# EAGLE design atmegaArduino (EAGLE 7.6.0)
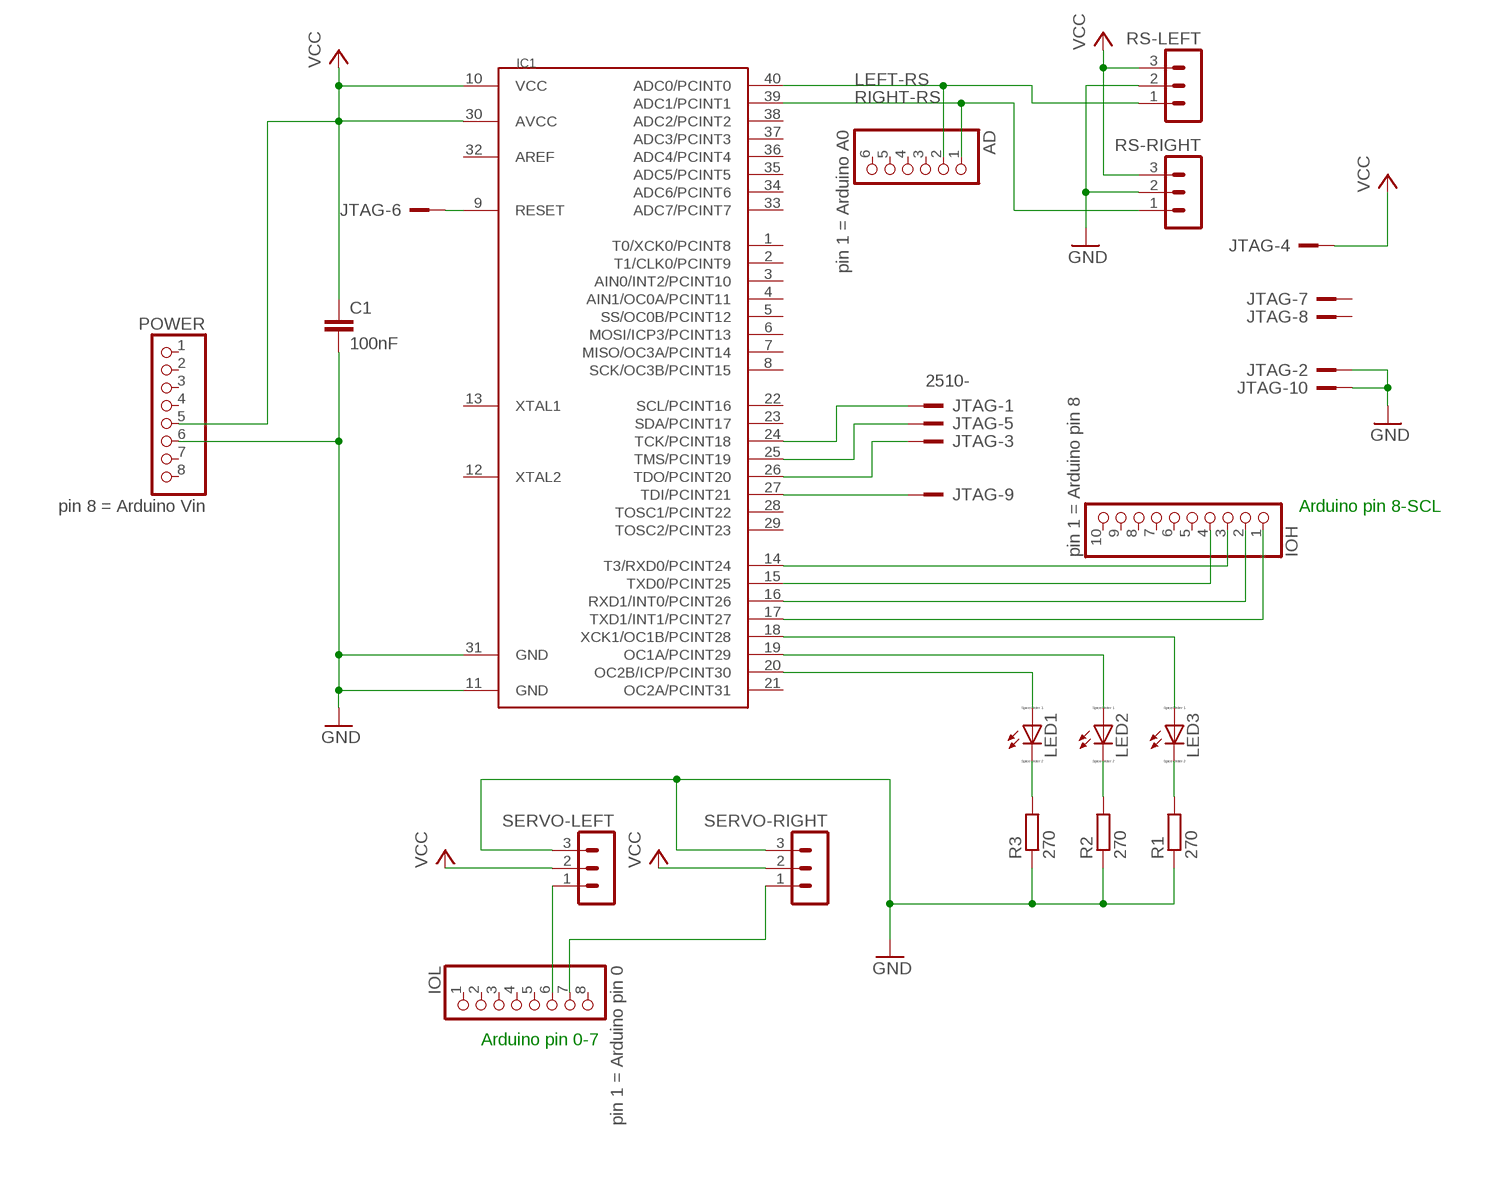
[diagram p0: schematic, sheet 1]

## Parts
AD  pin 1 = Arduino A0  PINHD-1X6/90  [1X06/90]
C1  100nF  C-EU050-025X075  [C050-025X075]
IC1  MEGA1284P  [DIL40]
IOH  pin 1 = Arduino pin 8  PINHD-1X10/90  [1X10/90]
IOL  pin 1 = Arduino pin 0  PINHD-1X8/90  [1X08/90]
JTAG  2510-  [PAK100/2500-10]
LED1  LED_ELD260  [LED_LD260]
LED2  LED_ELD260  [LED_LD260]
LED3  LED_ELD260  [LED_LD260]
POWER  pin 8 = Arduino Vin  PINHD-1X8/90  [1X08/90]
R1  270  R-EU_0204/5  [0204/5]
R2  270  R-EU_0204/5  [0204/5]
R3  270  R-EU_0204/5  [0204/5]
RS-LEFT  MA03-1  [MA03-1]
RS-RIGHT  MA03-1  [MA03-1]
SERVO-LEFT  MA03-1  [MA03-1]
SERVO-RIGHT  MA03-1  [MA03-1]

## Nets
GND: C1.2 IC1.11(GND) IC1.31(GND) JTAG.2 JTAG.10 POWER.6 R1.1 R2.1 R3.1 RS-LEFT.2 RS-RIGHT.2 SERVO-LEFT.3 SERVO-RIGHT.3
LEFT-RS: AD.2 IC1.40(ADC0/PCINT0) RS-LEFT.1
N$1: IC1.14(T3/RXD0/PCINT24) IOH.3
N$2: IC1.15(TXD0/PCINT25) IOH.4
N$3: IC1.24(TCK/PCINT18) JTAG.1
N$4: IC1.25(TMS/PCINT19) JTAG.5
N$6: IC1.26(TDO/PCINT20) JTAG.3
N$7: IOL.7 SERVO-RIGHT.1
N$8: IC1.27(TDI/PCINT21) JTAG.9
N$9: IOL.6 SERVO-LEFT.1
N$11: LED1.K(C) R3.2
N$14: LED2.K(C) R2.2
N$15: IC1.9(RESET) JTAG.6
N$16: LED3.K(C) R1.2
N$17: IC1.20(OC2B/ICP/PCINT30) LED1.A
N$18: IC1.19(OC1A/PCINT29) LED2.A
N$19: IC1.18(XCK1/OC1B/PCINT28) LED3.A
N$20: IC1.16(RXD1/INT0/PCINT26) IOH.2
N$21: IC1.17(TXD1/INT1/PCINT27) IOH.1
RIGHT-RS: AD.1 IC1.39(ADC1/PCINT1) RS-RIGHT.1
VCC: C1.1 IC1.10(VCC) IC1.30(AVCC) JTAG.4 POWER.5 RS-LEFT.3 RS-RIGHT.3 SERVO-LEFT.2 SERVO-RIGHT.2
Unconnected: AD.3 AD.4 AD.5 AD.6 IC1.1(T0/XCK0/PCINT8) IC1.2(T1/CLK0/PCINT9) IC1.3(AIN0/INT2/PCINT10) IC1.4(AIN1/OC0A/PCINT11) IC1.5(SS/OC0B/PCINT12) IC1.6(MOSI/ICP3/PCINT13) IC1.7(MISO/OC3A/PCINT14) IC1.8(SCK/OC3B/PCINT15) IC1.12(XTAL2) IC1.13(XTAL1) IC1.21(OC2A/PCINT31) IC1.22(SCL/PCINT16) IC1.23(SDA/PCINT17) IC1.28(TOSC1/PCINT22) IC1.29(TOSC2/PCINT23) IC1.32(AREF) IC1.33(ADC7/PCINT7) IC1.34(ADC6/PCINT6) IC1.35(ADC5/PCINT5) IC1.36(ADC4/PCINT4) IC1.37(ADC3/PCINT3) IC1.38(ADC2/PCINT2) IOH.5 IOH.6 IOH.7 IOH.8 IOH.9 IOH.10 IOL.1 IOL.2 IOL.3 IOL.4 IOL.5 IOL.8 JTAG.7 JTAG.8 POWER.1 POWER.2 POWER.3 POWER.4 POWER.7 POWER.8

## Notes on the sheet
- Arduino pin 8-SCL
- Arduino pin 0-7

## Library data of the parts
AD = pinhead:PINHD-1X6: PIN HEADER
C1 = rcl:C-EU: CAPACITOR, European symbol
IC1 = 1284p:MEGA1284P: Atmel ATmega1284P 8-bit AVR Microcontroller
IOH = pinhead:PINHD-1X10: PIN HEADER
IOL POWER = pinhead:PINHD-1X8: PIN HEADER
JTAG = con-3m:2510-: 3M (TM) Pak 100 4-Wall Header Source: 3M; MF: 3M; MPN: 2510-6002UB; OC_FARNELL: 9838244; OC_NEWARK: 46F4725
LED1-LED3 = eagle-ltspice:LED_E: LED Source: http://www.osram.convergy.de Source: www.luxeon.com Source: www.kingbright.com; SPICEMODEL: NONE; SPICEPREFIX: D; SPICETYPE: diode
R1-R3 = rcl:R-EU_: RESISTOR, European symbol
RS-LEFT RS-RIGHT SERVO-LEFT SERVO-RIGHT = con-lstb:MA03-1: PIN HEADER; OC_FARNELL: unknown; OC_NEWARK: unknown

## Board
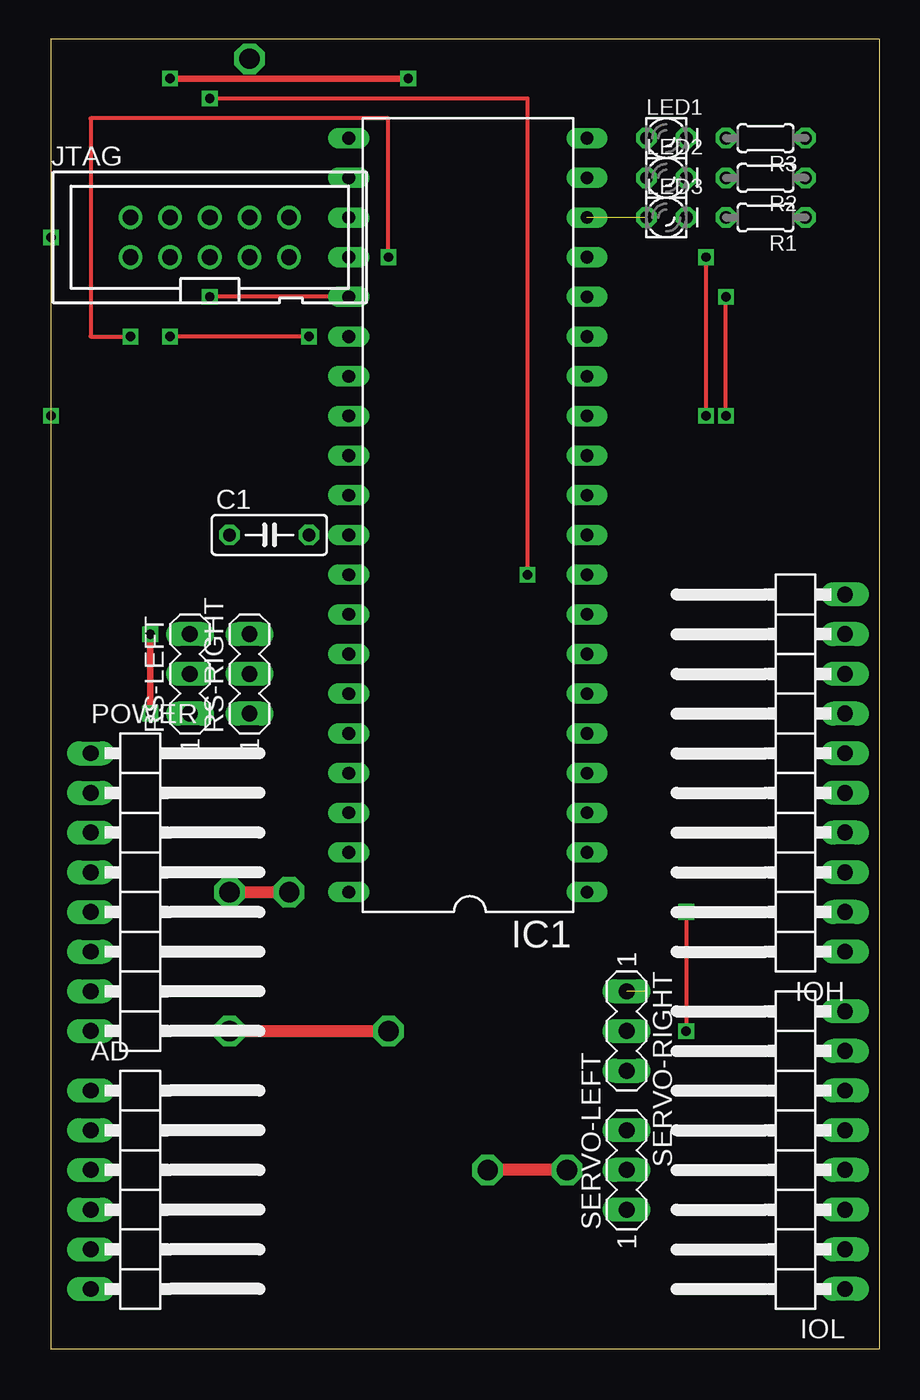
[diagram p1: board, top side]
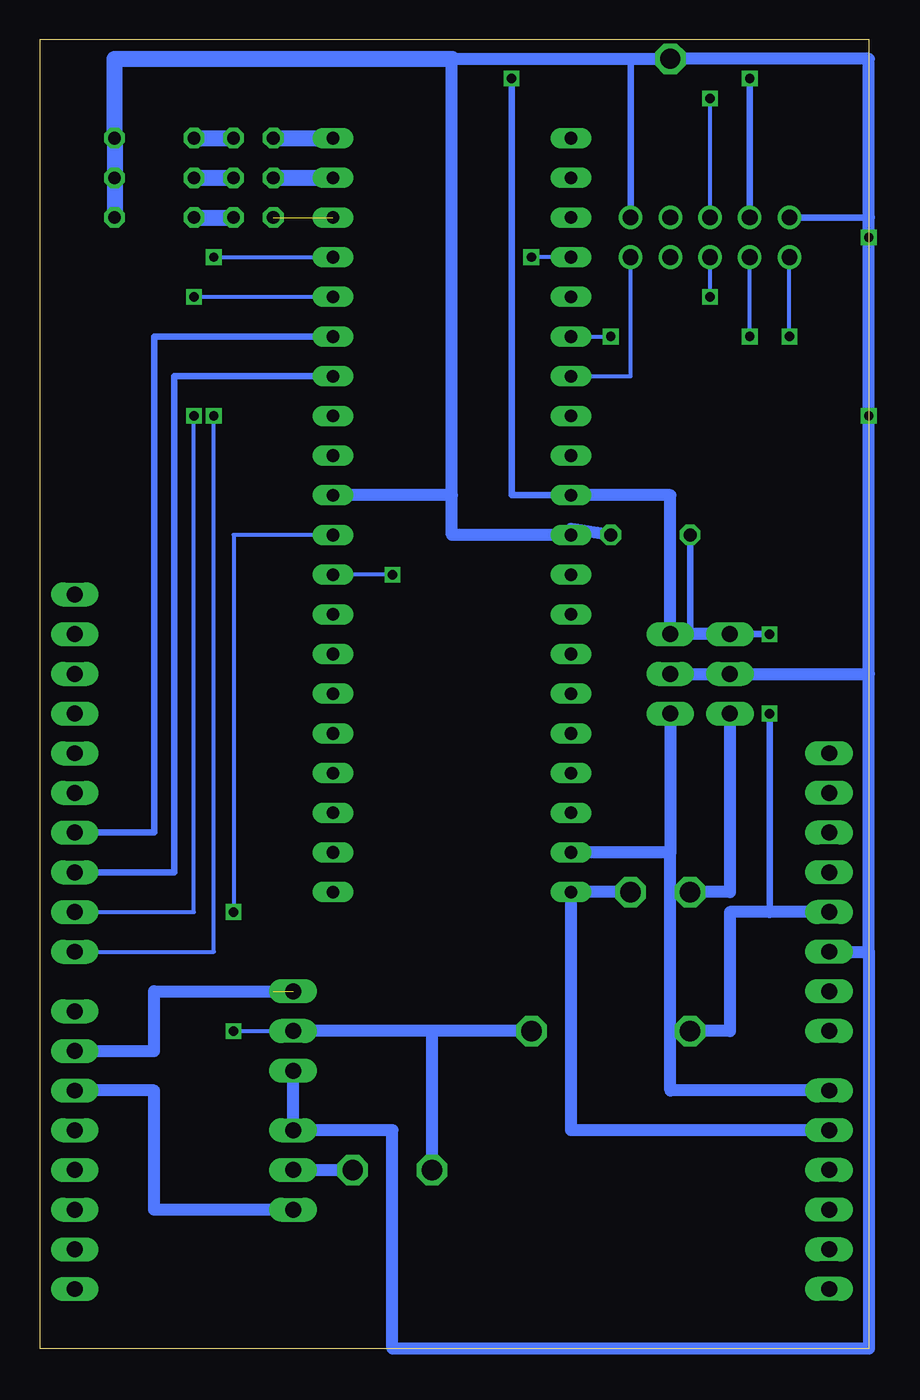
[diagram p2: board, bottom side, seen from below]

Size 53.01 x 83.81 mm. Coordinates in mm from the lower left corner, seen from the top.
Outline: 0,0 53.01,0 53.01,83.81 0,83.81 0,0
Copper layers (1*16): Top 0.035mm / dielectric 1.5mm / Bottom 0.035mm
Design rules "default": minimum track width 10mil, minimum drill 24mil, track to track 8mil, track to pad 8mil, pad to pad 8mil, via to via 8mil, smd to smd 8mil, copper to edge 40mil, drill to drill 8mil, minimum pad ring 10mil, minimum via ring 8mil, stop-mask expansion 4mil, vias tented up to drill 0mil, thermal gap 10mil

### Footprints (pad centres in the part's own frame; a part is rotated, then mirrored left to right if it is on the bottom)
1X06/90 = drill 1.016 long: 1 -6.35,-3.81; 2 -3.81,-3.81; 3 -1.27,-3.81; 4 1.27,-3.81; 5 3.81,-3.81; 6 6.35,-3.81
C050-025X075 = drill 0.813 octagon: 1 -2.54,0; 2 2.54,0
DIL40 = drill 0.813 long: 1 -24.13,-7.62; 2 -21.59,-7.62; 3 -19.05,-7.62; 4 -16.51,-7.62; 5 -13.97,-7.62; 6 -11.43,-7.62; 7 -8.89,-7.62; 8 -6.35,-7.62; 9 -3.81,-7.62; 10 -1.27,-7.62; 11 1.27,-7.62; 12 3.81,-7.62; 13 6.35,-7.62; 14 8.89,-7.62; 15 11.43,-7.62; 16 13.97,-7.62; 17 16.51,-7.62; 18 19.05,-7.62; 19 21.59,-7.62; 20 24.13,-7.62; 21 24.13,7.62; 22 21.59,7.62; 23 19.05,7.62; 24 16.51,7.62; 25 13.97,7.62; 26 11.43,7.62; 27 8.89,7.62; 28 6.35,7.62; 29 3.81,7.62; 30 1.27,7.62; 31 -1.27,7.62; 32 -3.81,7.62; 33 -6.35,7.62; 34 -8.89,7.62; 35 -11.43,7.62; 36 -13.97,7.62; 37 -16.51,7.62; 38 -19.05,7.62; 39 -21.59,7.62; 40 -24.13,7.62
1X10/90 = drill 1.016 long: 1 -11.43,-3.81; 2 -8.89,-3.81; 3 -6.35,-3.81; 4 -3.81,-3.81; 5 -1.27,-3.81; 6 1.27,-3.81; 7 3.81,-3.81; 8 6.35,-3.81; 9 8.89,-3.81; 10 11.43,-3.81
1X08/90 = drill 1.016 long: 1 -8.89,-3.81; 2 -6.35,-3.81; 3 -3.81,-3.81; 4 -1.27,-3.81; 5 1.27,-3.81; 6 3.81,-3.81; 7 6.35,-3.81; 8 8.89,-3.81
PAK100/2500-10 = drill 1 pad 1.422: 1 -5.08,-1.27; 2 -5.08,1.27; 3 -2.54,-1.27; 4 -2.54,1.27; 5 0,-1.27; 6 0,1.27; 7 2.54,-1.27; 8 2.54,1.27; 9 5.08,-1.27; 10 5.08,1.27
LED_LD260 = drill 0.813 octagon: A -1.27,0; K 1.27,0
0204/5 = drill 0.813 octagon: 1 -2.54,0; 2 2.54,0
MA03-1 = drill 1.016 long: 1 -2.54,0; 2 0,0; 3 2.54,0

### Placement (x,y rotation side)
AD  6.35,10.16 270 top
C1  13.97,52.07 0 top
IC1  26.67,53.34 90 top
IOH  46.99,36.83 90 top
IOL  46.99,12.7 90 top
JTAG  10.16,71.12 0 top
LED1  39.37,77.47 0 top
LED2  39.37,74.93 0 top
LED3  39.37,72.39 0 top
POWER  6.35,29.21 270 top
R1  45.72,72.39 180 top
R2  45.72,74.93 180 top
R3  45.72,77.47 180 top
RS-LEFT  8.89,43.18 90 top
RS-RIGHT  12.7,43.18 90 top
SERVO-LEFT  36.83,11.43 90 top
SERVO-RIGHT  36.83,20.32 270 top

### Tracks (layer width: path | path; a pad name or v marks a point on that pad's centre or on a via)
GND  (via drill 0.6, 1.3)
  Bottom 0.406: JTAG.2 0,72.39 | JTAG.10 15.24,82.55
  Bottom 0.762: 0,25.4 0,43.18 | 0,43.18 v0,59.69 v0,71.12 0,72.39 0,82.55 v12.7,82.55 15.24,82.55 26.67,82.55 26.67,54.61 | POWER.6 0,25.4 | 0,25.4 0,0 30.48,0 30.48,13.97 SERVO-LEFT.3 SERVO-RIGHT.3 | 26.67,54.61 26.67,52.07 IC1.31 19.05,52.45 C1.2 | 26.67,54.61 IC1.11 | RS-LEFT.2 RS-RIGHT.2 0,43.18
  Bottom 1.016: 26.67,82.55 48.26,82.55 R3.1 R2.1 R1.1
LEFT-RS  (via drill 1.3)
  Top 0.762: v11.43,29.21 v15.24,29.21
  Bottom 0.762: AD.2 19.05,13.97 IC1.40 v15.24,29.21 | RS-LEFT.1 8.89,29.21 v11.43,29.21
N$1
  Bottom 0.406: IC1.14 44.45,62.23 44.45,30.48 IOH.3
N$2
  Bottom 0.406: IOH.4 45.72,33.02 45.72,64.77 IC1.15
N$3  (via drill 0.6)
  Top 0.254: v21.59,69.85 21.59,78.74 2.54,78.74 2.54,64.77 v5.08,64.77
  Bottom 0.254: IC1.24 v21.59,69.85 | v5.08,64.77 JTAG.1
N$4  (via drill 0.6)
  Top 0.254: IC1.25 v10.16,67.31
  Bottom 0.254: v10.16,67.31 JTAG.5
N$6  (via drill 0.6)
  Top 0.254: v16.51,64.77 v7.62,64.77
  Bottom 0.254: IC1.26 v16.51,64.77 | v7.62,64.77 JTAG.3
N$7  (1 unrouted)
  Bottom 0.762: IOL.7 45.72,19.05 45.72,22.86 38.1,22.86
N$8
  Bottom 0.254: IC1.27 15.24,62.23 JTAG.9
N$9
  Bottom 0.762: SERVO-LEFT.1 45.72,8.89 45.72,16.51 IOL.6
N$11
  Bottom 1.016: R3.2 LED1.K
N$14
  Bottom 1.016: R2.2 LED2.K
N$15  (via drill 0.6)
  Top 0.254: v10.16,80.01 30.48,80.01 v30.48,49.53
  Bottom 0.254: JTAG.6 v10.16,80.01 | v30.48,49.53 IC1.9
N$16
  Bottom 1.016: R1.2 LED3.K
N$17
  Bottom 1.016: LED1.A IC1.20
N$18
  Bottom 1.016: LED2.A IC1.19
N$19  (1 unrouted)
N$20  (via drill 0.6)
  Top 0.254: v43.18,59.69 v43.18,67.31
  Bottom 0.254: IOH.2 43.18,27.94 v43.18,59.69 | v43.18,67.31 IC1.16
N$21  (via drill 0.6)
  Top 0.254: v41.91,59.69 v41.91,69.85
  Bottom 0.254: IOH.1 41.91,25.4 v41.91,59.69 | v41.91,69.85 IC1.17
RIGHT-RS
  Bottom 0.762: AD.1 12.7,16.51 12.7,31.75 | RS-RIGHT.1 12.7,31.75 | 12.7,31.75 IC1.39
VCC  (via drill 0.6, 1.3)
  Top 0.254: v40.64,27.94 v40.64,20.32
  Top 0.406: v7.62,81.28 v22.86,81.28 | v6.35,45.72 v6.35,40.64
  Top 0.762: v33.02,11.43 v27.94,11.43 | v11.43,20.32 v21.59,20.32
  Bottom 0.254: IC1.10 40.64,52.07 v40.64,27.94 | v40.64,20.32 SERVO-RIGHT.2
  Bottom 0.406: C1.1 11.43,45.72 RS-LEFT.3 v6.35,45.72 | v22.86,81.28 22.86,54.61 IC1.30 | v6.35,40.64 6.35,27.94 | JTAG.4 v7.62,81.28
  Bottom 0.762: SERVO-LEFT.2 v33.02,11.43 | v27.94,11.43 27.94,20.32 | 27.94,20.32 SERVO-RIGHT.2 | POWER.5 6.35,27.94 8.89,27.94 8.89,20.32 v11.43,20.32 | v21.59,20.32 27.94,20.32 | RS-LEFT.3 RS-RIGHT.3 12.7,54.61 IC1.30